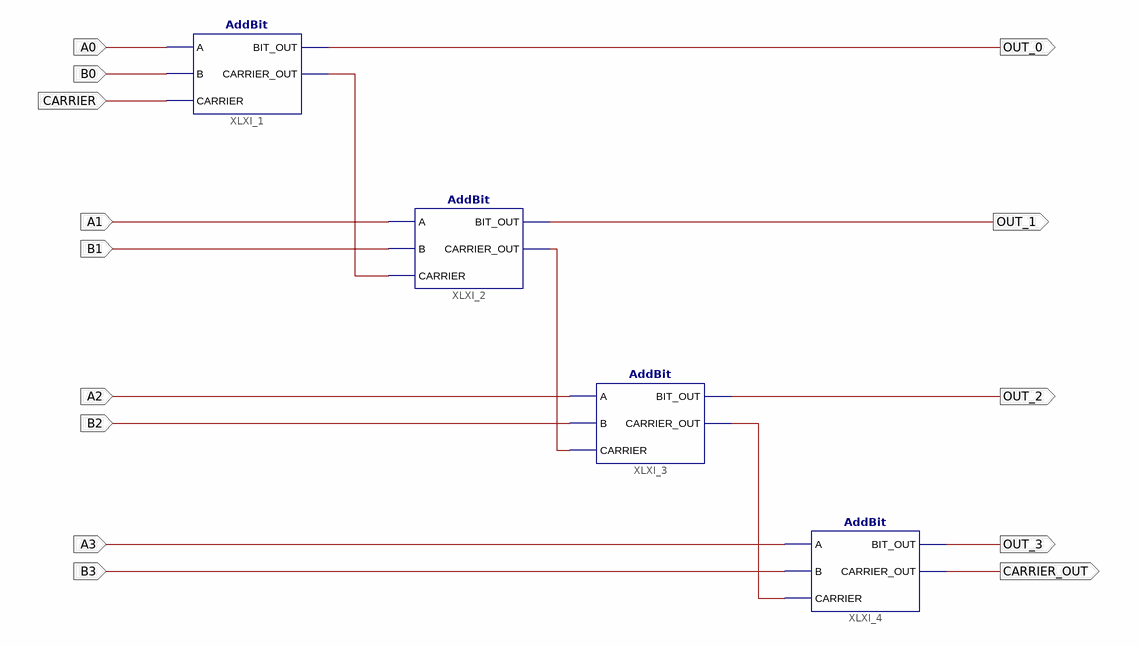
[diagram p0: schematic sheet 1]
// Xilinx ISE schematic Adder4Bits.sch (spartan6) as structural Verilog: 4 symbols, 14 ports
module Adder4Bits (
  input  A1,
  input  A0,
  input  B0,
  input  CARRIER,
  input  B1,
  input  A2,
  input  B2,
  input  A3,
  input  B3,
  output CARRIER_OUT,
  output OUT_3,
  output OUT_2,
  output OUT_1,
  output OUT_0
);

  wire XLXN_1, XLXN_2, XLXN_3;

  AddBit XLXI_1 (.A(A0), .B(B0), .BIT_OUT(OUT_0), .CARRIER(CARRIER), .CARRIER_OUT(XLXN_1));
  AddBit XLXI_2 (.A(A1), .B(B1), .BIT_OUT(OUT_1), .CARRIER(XLXN_1), .CARRIER_OUT(XLXN_2));
  AddBit XLXI_3 (.A(A2), .B(B2), .BIT_OUT(OUT_2), .CARRIER(XLXN_2), .CARRIER_OUT(XLXN_3));
  AddBit XLXI_4 (.A(A3), .B(B3), .BIT_OUT(OUT_3), .CARRIER(XLXN_3), .CARRIER_OUT(CARRIER_OUT));
endmodule
